# EAGLE design solenoid_tip120 (EAGLE 5.08)
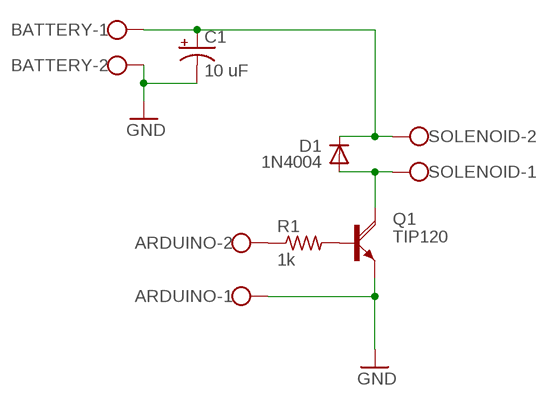
[diagram p0: schematic, sheet 1]

## Parts
ARDUINO  W237-02P  [W237-132]
BATTERY  W237-02P  [W237-132]
C1  10 uF  CAP_POLPTH2  [CPOL-RADIAL-10UF-25V]
D1  1N4004  [DO41-10]
Q1  TIP120  [TO220AH]
R1  1k  R-US_0207/12  [0207/12]
SOLENOID  W237-02P  [W237-132]

## Nets
GND: ARDUINO.1 BATTERY.2 C1.2(-) Q1.E
N$1: Q1.B R1.2
N$2: ARDUINO.2 R1.1
N$3: D1.A Q1.C SOLENOID.1
N$4: BATTERY.1 C1.1(+) D1.C SOLENOID.2

## Library data of the parts
ARDUINO BATTERY SOLENOID = con-wago-508:W237-02P: WAGO SREW CLAMP
C1 = SparkFun:CAP_POL: Capacitor Polarized These are standard SMD and PTH capacitors. Normally 10uF, 47uF, and 100uF in electrolytic and tantalum varieties. Always verify the external diameter of the through hole cap, it varies with capacity, voltage, and manufacturer. The EIA devices should be standard.
D1 = diode:1N4004: DIODE general purpose rectifier, 1 A
Q1 = transistor-power:TIP120: NPN DARLINGTON TRANSISTOR
R1 = rcl:R-US_: RESISTOR, American symbol

## Board
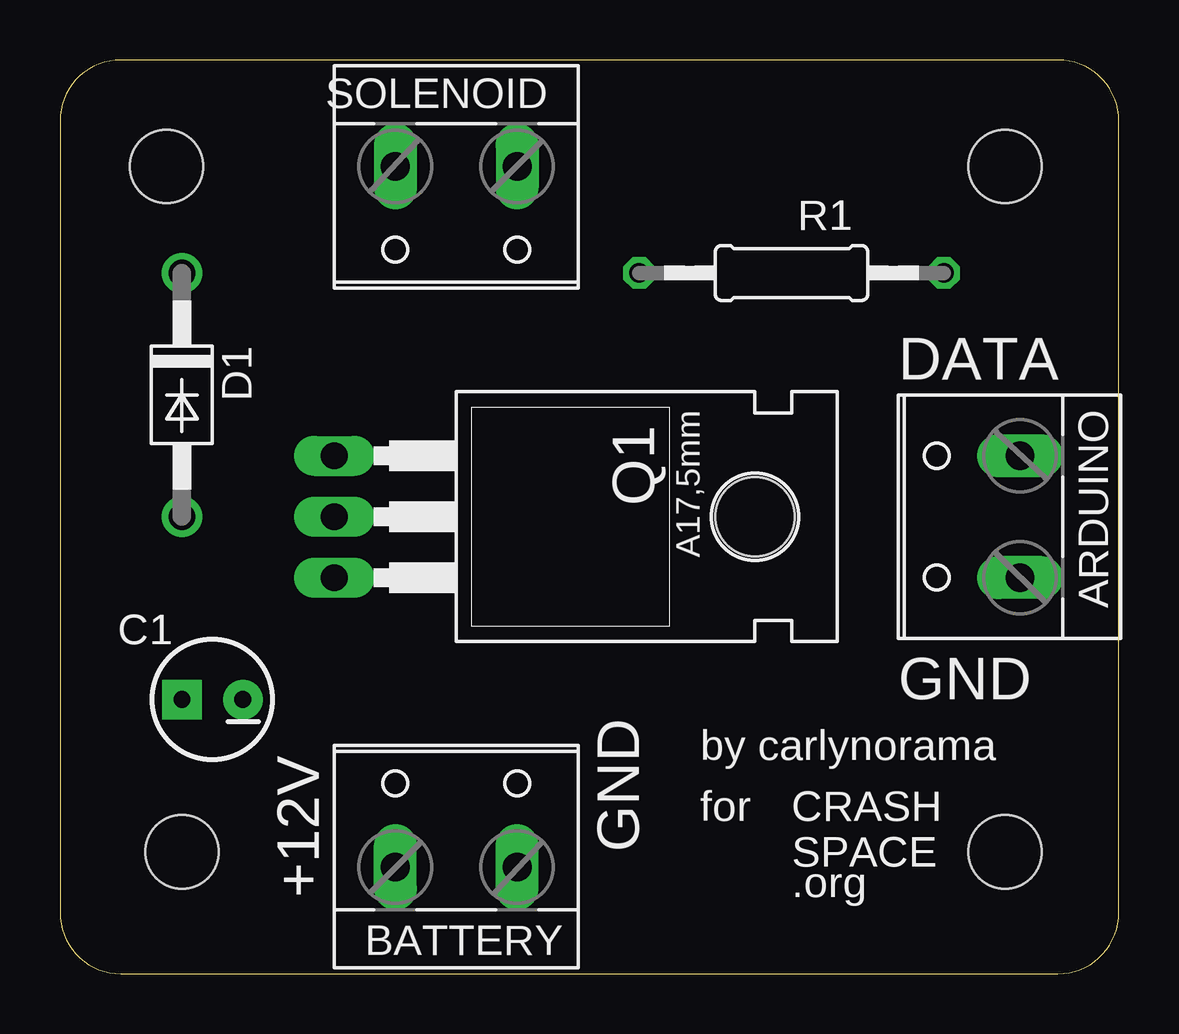
[diagram p1: board, top side]
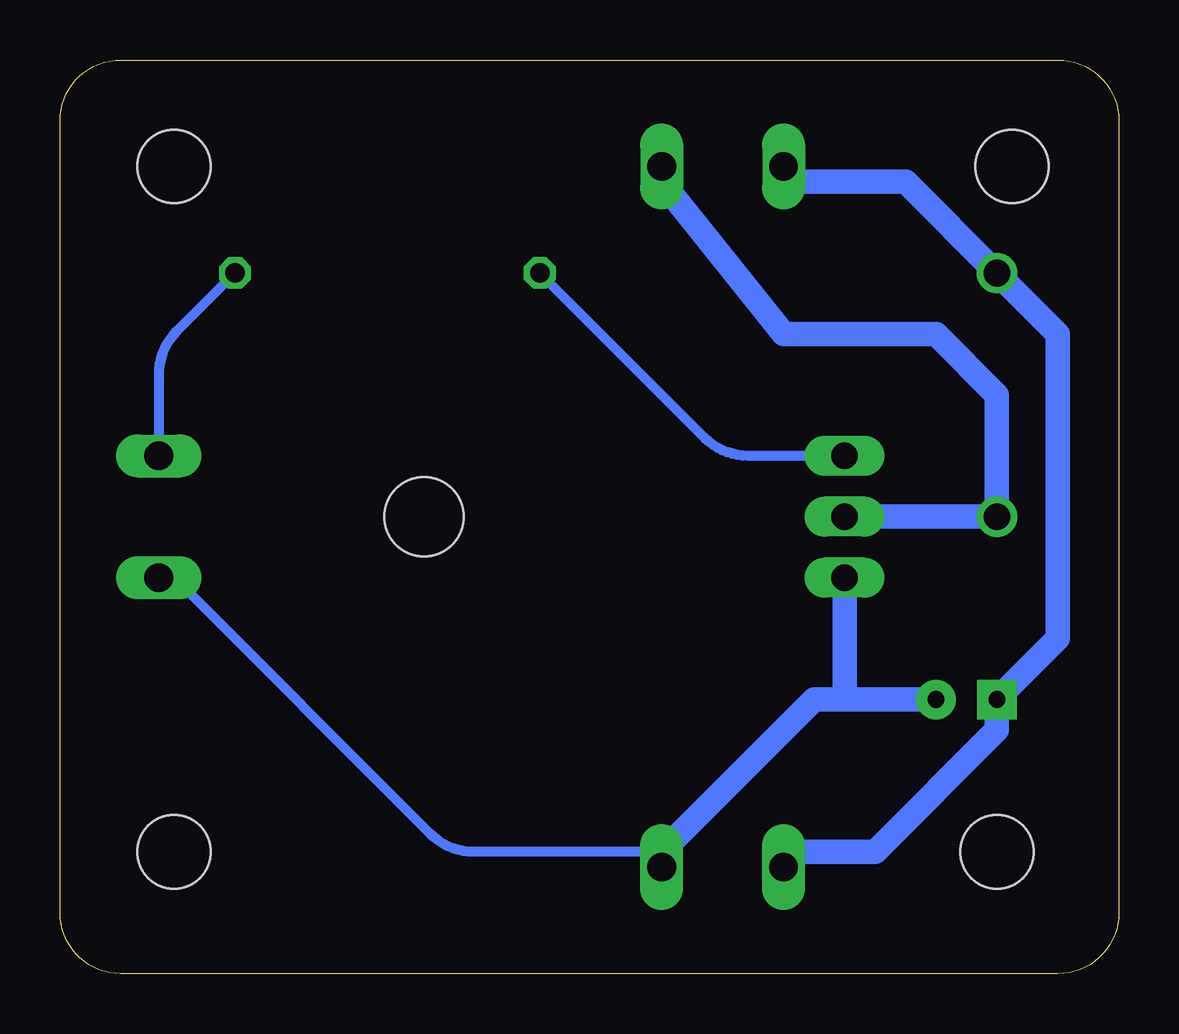
[diagram p2: board, bottom side, seen from below]

Size 44.12 x 38.09 mm. Coordinates in mm from the lower left corner, seen from the top.
Outline: 2.54,38.09 arc90 0,35.55 0,2.54 arc90 2.54,0 41.58,0 arc90 44.12,2.54 44.12,35.55 arc90 41.58,38.09 2.54,38.09
Copper layers (1*16): Top 0.035mm / dielectric 1.5mm / Bottom 0.035mm
Design rules "default": minimum track width 10mil, minimum drill 24mil, track to track 8mil, track to pad 8mil, pad to pad 8mil, via to via 8mil, smd to smd 8mil, copper to edge 40mil, drill to drill 8mil, minimum pad ring 10mil, minimum via ring 8mil, stop-mask expansion 4mil, vias tented up to drill 0mil, thermal gap 10mil

### Footprints (pad centres in the part's own frame; a part is rotated, then mirrored left to right if it is on the bottom)
W237-132 = drill 1.194 long: 1 -2.54,-0.635; 2 2.54,-0.635
CPOL-RADIAL-10UF-25V = drill 0.7 pad 1.651 square: 1 1.27,0 | drill 0.7 pad 1.651 round: 2 -1.27,0
DO41-10 = drill 1.118 round: A 5.08,0; C -5.08,0
TO220AH = drill 1.118 long: B -2.54,-6.35; C 0,-6.35; E 2.54,-6.35 | hole 3.302: 0,11.176
0207/12 = drill 0.813 octagon: 1 -6.35,0; 2 6.35,0
STAND-OFF-TIGHT = hole 3.048: 0,0

### Placement (x,y rotation side)
ARDUINO  39.37,19.05 90 top
BATTERY  16.51,5.08 0 top
C1  6.35,11.43 180 top
D1  5.08,24.13 270 top
Q1  17.78,19.05 270 top
R1  30.48,29.21 180 top
SOLENOID  16.51,33.02 180 top
U$1  [STAND-OFF-TIGHT]  39.37,33.66 0 top
U$2  [STAND-OFF-TIGHT]  39.37,5.08 0 top
U$3  [STAND-OFF-TIGHT]  4.45,33.66 0 top
U$4  [STAND-OFF-TIGHT]  5.08,5.08 0 top

### Tracks (layer width: path | path; a pad name or v marks a point on that pad's centre or on a via)
GND
  Bottom 0.254: 39.37,16.51 ARDUINO.1 | 19.05,5.08 BATTERY.2
  Bottom 0.406: 39.37,16.51 28.68,5.82 arc-45 26.89,5.08 19.05,5.08
  Bottom 1.016: 19.05,5.08 12.7,11.43 11.43,11.43 | C1.2 11.43,11.43 | 11.43,11.43 Q1.E
N$1
  Bottom 0.406: R1.2 17.25,22.33 arc-45 15.46,21.59 Q1.B
N$2
  Bottom 0.406: R1.1 39.26,26.78 arc-45 40.01,24.98 ARDUINO.2
N$3
  Bottom 0.254: 19.05,33.02 SOLENOID.1
  Bottom 1.016: Q1.C D1.A 5.08,24.13 7.62,26.67 13.97,26.67 19.05,33.02
N$4
  Bottom 0.254: 13.97,33.02 SOLENOID.2
  Bottom 1.016: 13.97,33.02 8.89,33.02 D1.C 2.54,26.67 2.54,13.97 C1.1 5.08,10.16 10.16,5.08 13.34,5.08 BATTERY.1

### Text on the board
tNames: DATA | GND | by carlynorama | for | CRASH | GND | SPACE | +12V | .org